# EAGLE design powersupply (EAGLE 7.3.0)
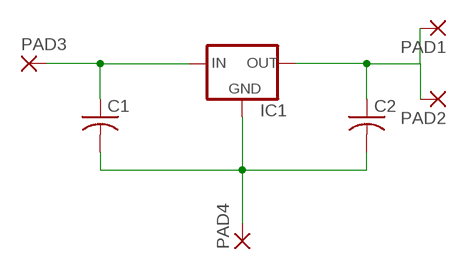
[diagram p0: schematic, sheet 1]

## Parts
C1  C-US025-040X050  [C025-040X050]
C2  C-US025-040X050  [C025-040X050]
IC1  78MXXL  [78MXXL]
PAD1  2,54/1,1  [2,54/1,1]
PAD2  2,54/1,1  [2,54/1,1]
PAD3  2,54/1,1  [2,54/1,1]
PAD4  2,54/1,1  [2,54/1,1]

## Nets
N$1: C1.1 IC1.IN PAD3.1(P)
N$2: C1.2 C2.2 IC1.GND PAD4.1(P)
N$3: C2.1 IC1.OUT PAD1.1(P) PAD2.1(P)

## Library data of the parts
C1 C2 = rcl:C-US: CAPACITOR, American symbol
IC1 = v-reg:78MXXL: VOLTAGE REGULATOR
PAD1-PAD4 = wirepad:2,54/1,1: THROUGH-HOLE PAD

## Board
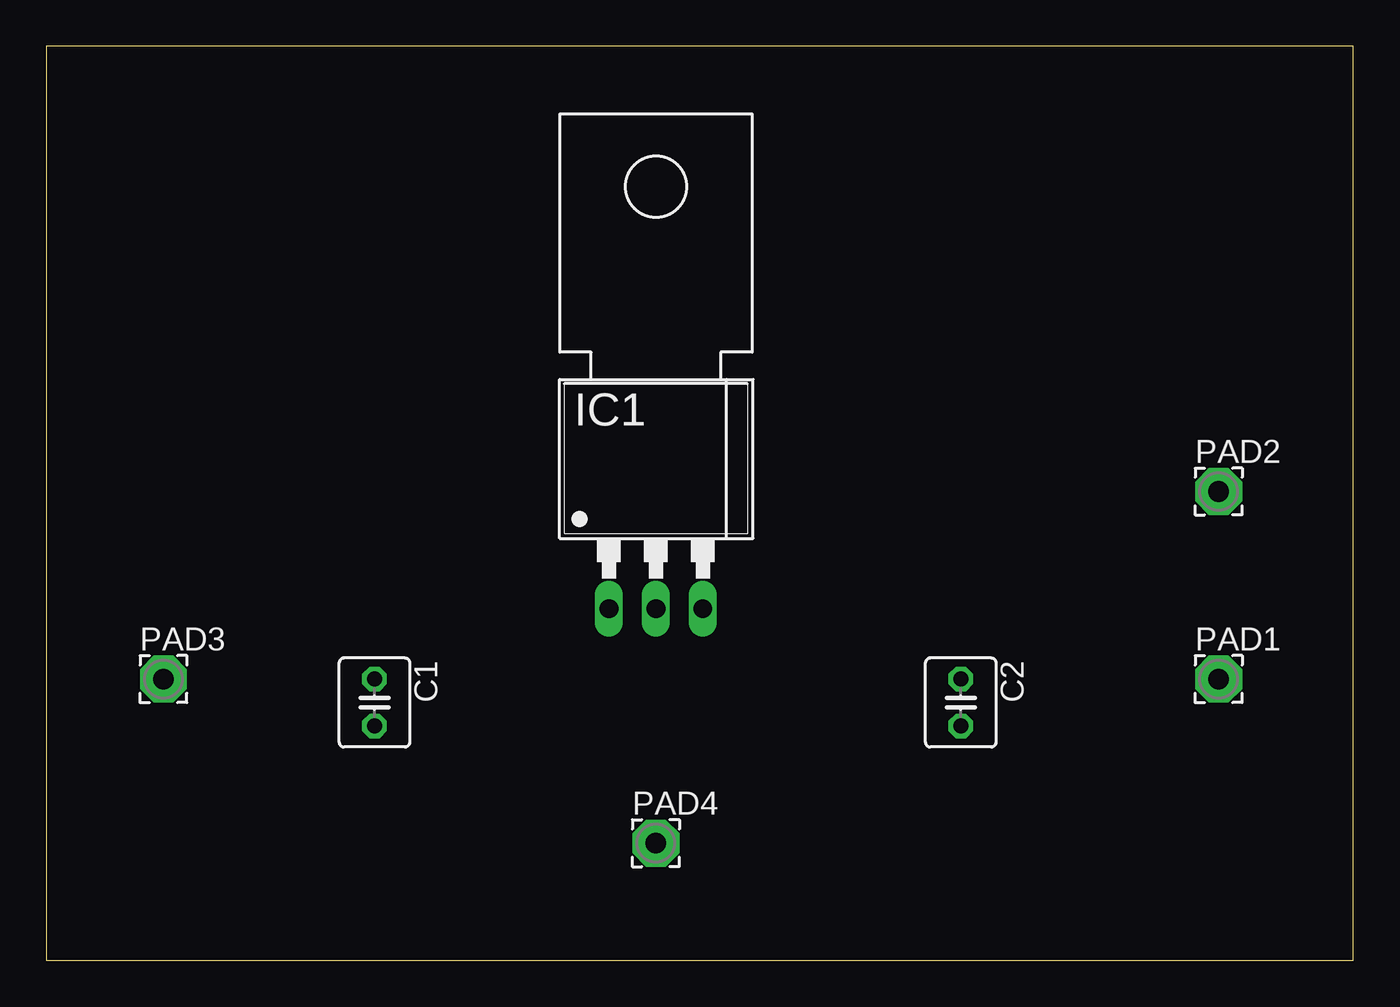
[diagram p1: board, top side]
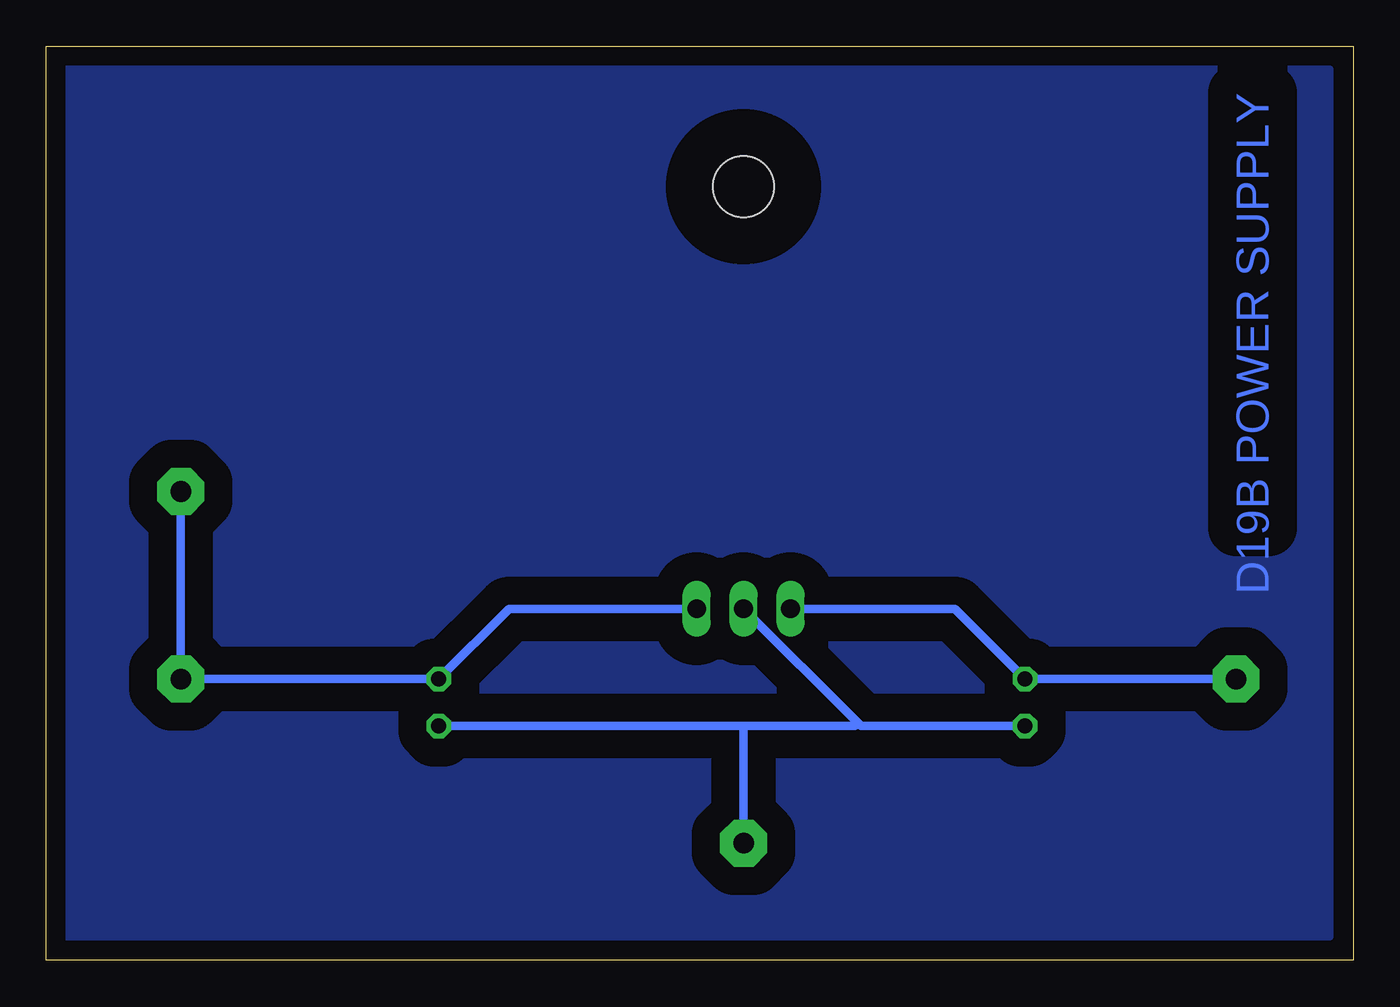
[diagram p2: board, bottom side, seen from below]

Size 70.79 x 49.52 mm. Coordinates in mm from the lower left corner, seen from the top.
Outline: 0,0 70.79,0 70.79,49.52 0,49.52 0,0
Copper layers (1*16): Top 0.035mm / dielectric 1.5mm / Bottom 0.035mm
Design rules "default *": minimum track width 18mil, minimum drill 24mil, track to track 60mil, track to pad 60mil, pad to pad 60mil, via to via 60mil, smd to smd 60mil, copper to edge 40mil, drill to drill 8mil, minimum pad ring 10mil, minimum via ring 8mil, stop-mask expansion 4mil, vias tented up to drill 0mil, thermal gap 10mil

### Footprints (pad centres in the part's own frame; a part is rotated, then mirrored left to right if it is on the bottom)
C025-040X050 = drill 0.813 octagon: 1 -1.27,0; 2 1.27,0
78MXXL = drill 1.016 long: GND 0,-5.08; IN -2.54,-5.08; OUT 2.54,-5.08 | hole 3.302: 0,17.78
2,54/1,1 = drill 1.118 pad 2.54 octagon: 1 0,0

### Placement (x,y rotation side)
C1  17.78,13.97 270 top
C2  49.53,13.97 270 top
IC1  33.02,24.13 0 top
PAD1  63.5,15.24 0 top
PAD2  63.5,25.4 0 top
PAD3  6.35,15.24 0 top
PAD4  33.02,6.35 0 top

### Tracks (layer width: path | path; a pad name or v marks a point on that pad's centre or on a via)
N$1
  Bottom 0.457: PAD3.1 C1.1 21.59,19.05 IC1.IN
N$2
  Bottom 0.457: C1.2 26.67,12.7 26.83,12.86 | IC1.GND 26.83,12.86 | 33.02,12.7 26.99,12.7 26.83,12.86 | 33.02,12.7 C2.2 | 33.02,12.7 PAD4.1
N$3
  Bottom 0.457: IC1.OUT 45.72,19.05 C2.1 PAD1.1 PAD2.1
N$4
  pour Bottom: 1.27,1.27 1.27,48.26 69.85,48.26 69.85,1.27

### Text on the board
Bottom: D19B POWER SUPPLY